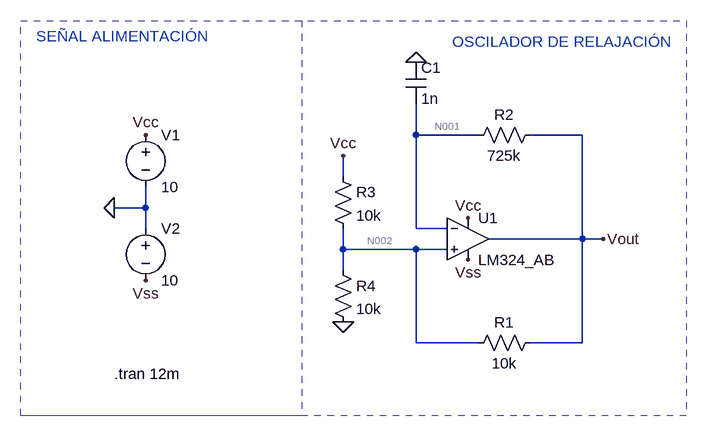
[diagram p0: schematic Relax_Osc.asc]
* Relax_Osc.asc
V1 Vcc 0 10
R1 Vout N002 10k
R2 Vout N001 725k
R4 N002 0 10k
R3 Vcc N002 10k
C1 0 N001 1n
* U1: LM324_AB (symbol ZZZ\OpAmp\LM324_AB not available, pins judged from their places): In+=N002 In-=N001 V+=Vcc V-=Vss OUT=Vout
V2 0 Vss 10
.tran 12m
* SEÑAL ALIMENTACIÓN
* OSCILADOR DE RELAJACIÓN
.backanno
.end

* Results of the author's LTspice run, read from the files saved beside the schematic
* Operating Point, zero values left out:
*   V(vcc) = 10 V
*   V(vout) = 4.957 V
*   V(n002) = 4.986 V
*   V(n001) = 4.986 V
*   V(vss) = -10 V
*   I(R3) = 501.4 µA
*   I(R4) = 498.6 µA
*   I(R2) = -40.14 nA
*   I(R1) = -2.909 µA
*   I(V2) = -358.5 µA
*   I(V1) = -857.1 µA
*   Ix(u1:IN+) = -39.08 nA
*   Ix(u1:IN-) = -40.14 nA
*   Ix(u1:VCC) = 355.6 µA
*   Ix(u1:VSS) = -358.5 µA
*   Ix(u1:OUT) = 2.95 µA
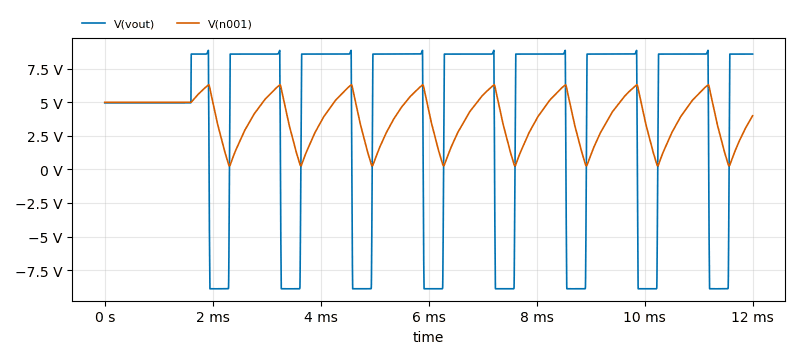
[diagram p1: Transient Analysis of Relax_Osc.asc, plotted from the saved traces]
* Transient Analysis, 1 run:
*   V(vout): min -8.889 V, max 8.859 V, average 3.714 V, rms 8.168 V, last 8.584 V
*   V(n001): min 254.7 mV, max 6.298 V, average 3.802 V, rms 4.217 V, last 3.99 V